# EAGLE design BSPDTesting (EAGLE 7.6.0)
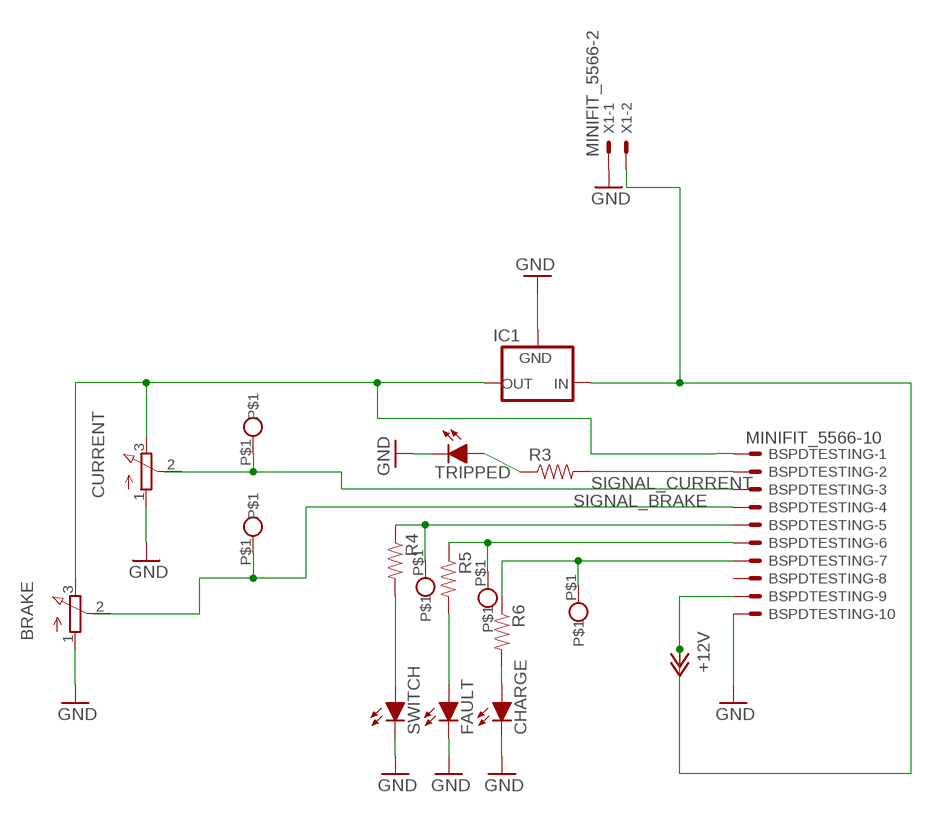
[diagram p0: schematic, sheet 1]

## Parts
BRAKE  3RP/1610N  [3RP/1610N]
BRAKEPROBE  TEST_POINT_COMPACT_THM  [TEST_POINT_COMPACT_THM]
BSPDTESTING  MINIFIT_5566-10  [MINIFIT_5566-10]
CHARGE  LED-3MM  [LED-3MM]
CURRENT  3RP/1610N  [3RP/1610N]
CURRENTPROBE  TEST_POINT_COMPACT_THM  [TEST_POINT_COMPACT_THM]
FAULT  LED-3MM  [LED-3MM]
IC1  5VREG_L7805_HOR  [TO-220-H]
R3  RESISTORAXIAL-0.3  [AXIAL-0.3]
R4  RESISTORAXIAL-0.3  [AXIAL-0.3]
R5  RESISTORAXIAL-0.3  [AXIAL-0.3]
R6  RESISTORAXIAL-0.3  [AXIAL-0.3]
SWITCH  LED-3MM  [LED-3MM]
TRIPPED  LED-3MM  [LED-3MM]
U$3  TEST_POINT_COMPACT_THM  [TEST_POINT_COMPACT_THM]
U$4  TEST_POINT_COMPACT_THM  [TEST_POINT_COMPACT_THM]
U$5  TEST_POINT_COMPACT_THM  [TEST_POINT_COMPACT_THM]
X1  MINIFIT_5566-2  [MINIFIT_5566-2]

## Nets
+12V: BSPDTESTING.9 IC1.1(IN) X1.2
GND: BRAKE.1(A) BSPDTESTING.10 CHARGE.K(C) CURRENT.1(A) FAULT.K(C) IC1.2(GND) SWITCH.K(C) TRIPPED.K(C) X1.1
N$1: BSPDTESTING.1
N$2: BSPDTESTING.2 R3.P$2
N$3: R3.P$1 TRIPPED.A
N$8: FAULT.A R5.P$2
N$9: BSPDTESTING.5 R4.P$1 U$3.P$1
N$10: BSPDTESTING.6 R5.P$1 U$4.P$1
N$12: R4.P$2 SWITCH.A
N$13: CHARGE.A R6.P$2
N$14: BSPDTESTING.7 R6.P$1 U$5.P$1
N$15: BRAKE.3(E) CURRENT.3(E) IC1.3(OUT)
SIGNAL_BRAKE: BRAKEPROBE.P$1 BSPDTESTING.4
SIGNAL_CURRENT: BSPDTESTING.3 CURRENTPROBE.P$1
Unconnected: BRAKE.2(S) BSPDTESTING.8 CURRENT.2(S)

## Library data of the parts
BRAKE CURRENT = HyTechDevices:3RP/1610N: 16mm Potentiometer one level Source: http://www.alphapotentiometers.net/html/16mm_pot_2.html
BRAKEPROBE CURRENTPROBE U$3-U$5 = HyTechDevices:TEST_POINT_COMPACT_THM
BSPDTESTING = HyTechDevices:MINIFIT_5566-10: Mini-Fit Junior connector 10 pole Source: http://www.molex.com; OC_FARNELL: unknown; OC_NEWARK: unknown
CHARGE FAULT SWITCH TRIPPED = HyTechDevices:LED: Light Emitting Diode (LED) Source: Dangerous Prototypes Eagle Library <https://github.com/DangerousPrototypes/Eagle_Part_Library>
IC1 = HyTechDevices:5VREG_L7805: Voltage Regulator Switching 5v regulator Datasheet <http://power.murata.com/data/power/oki-78sr.pdf> Standard 7805 5V regulator. IGO (Input Ground Output). Spark Fun Electronics SKU : COM-00107 Datasheet <http://www.mouser.com/ds/2/308/MC7800-D-94905.pdf>
R3-R6 = HyTechDevices:RESISTOR: Resistor Basic schematic elements and footprints for 0603, 1206, and PTH resistors.
X1 = HyTechDevices:MINIFIT_5566-2: Mini-Fit Junior connector 2 pole Source: http://www.molex.com; OC_FARNELL: 1822072; OC_NEWARK: unknown

## Board
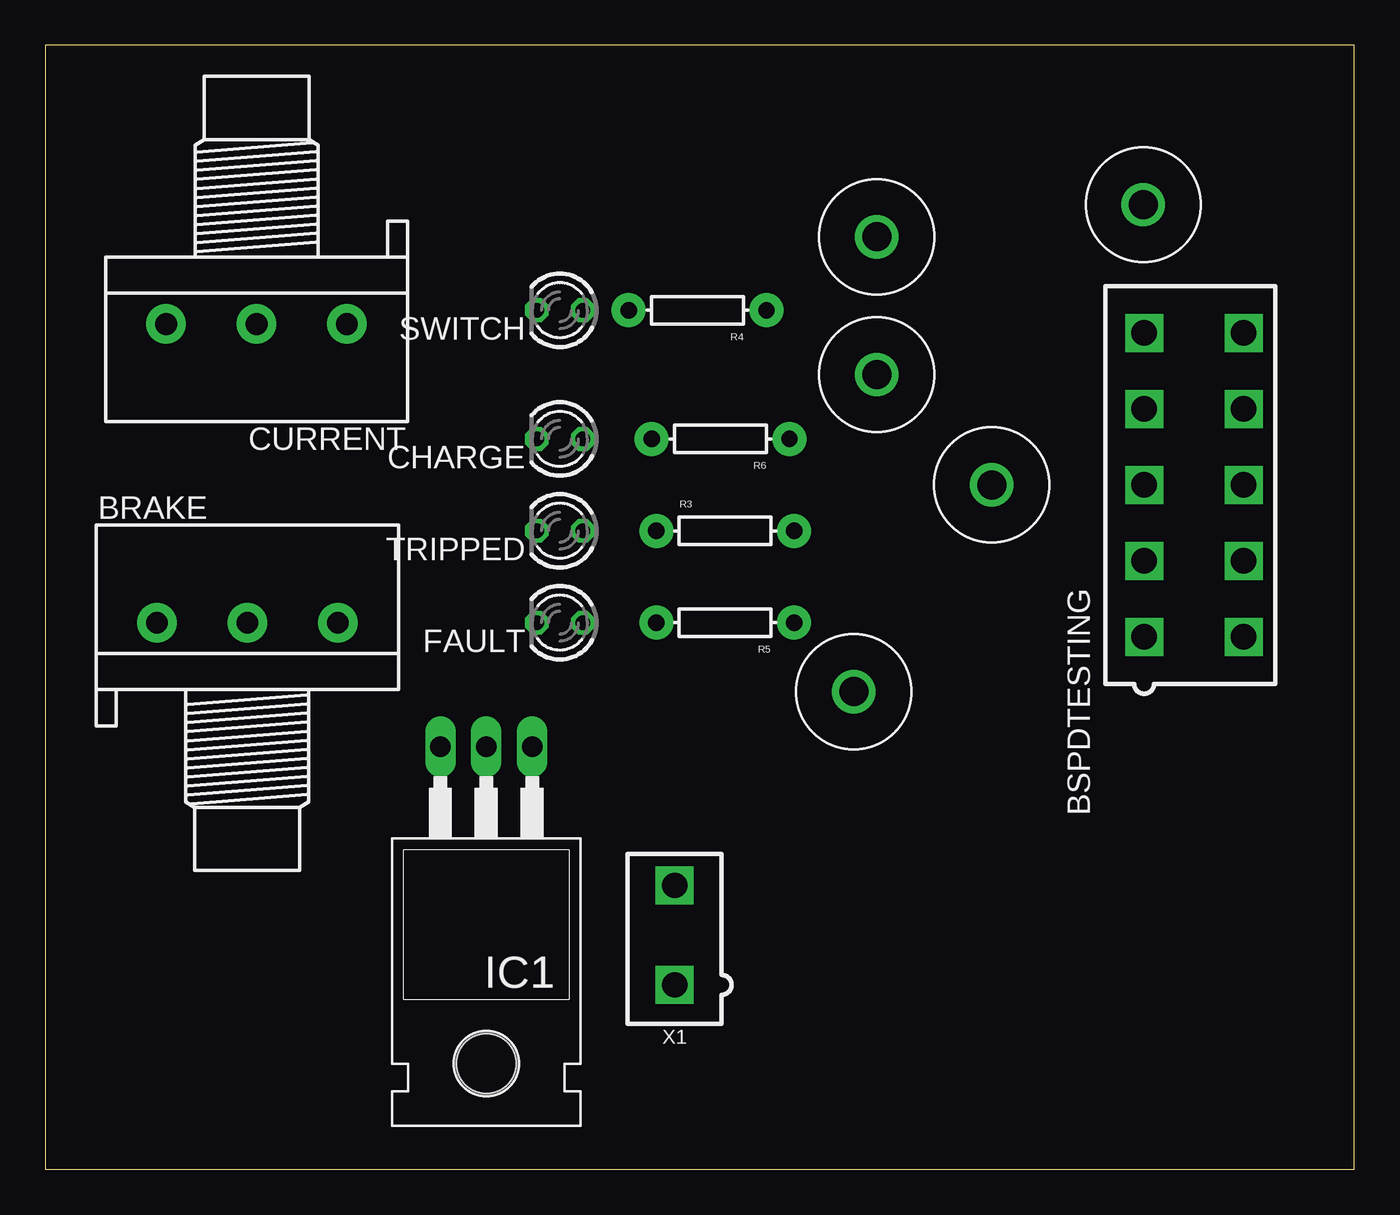
[diagram p1: board, top side]
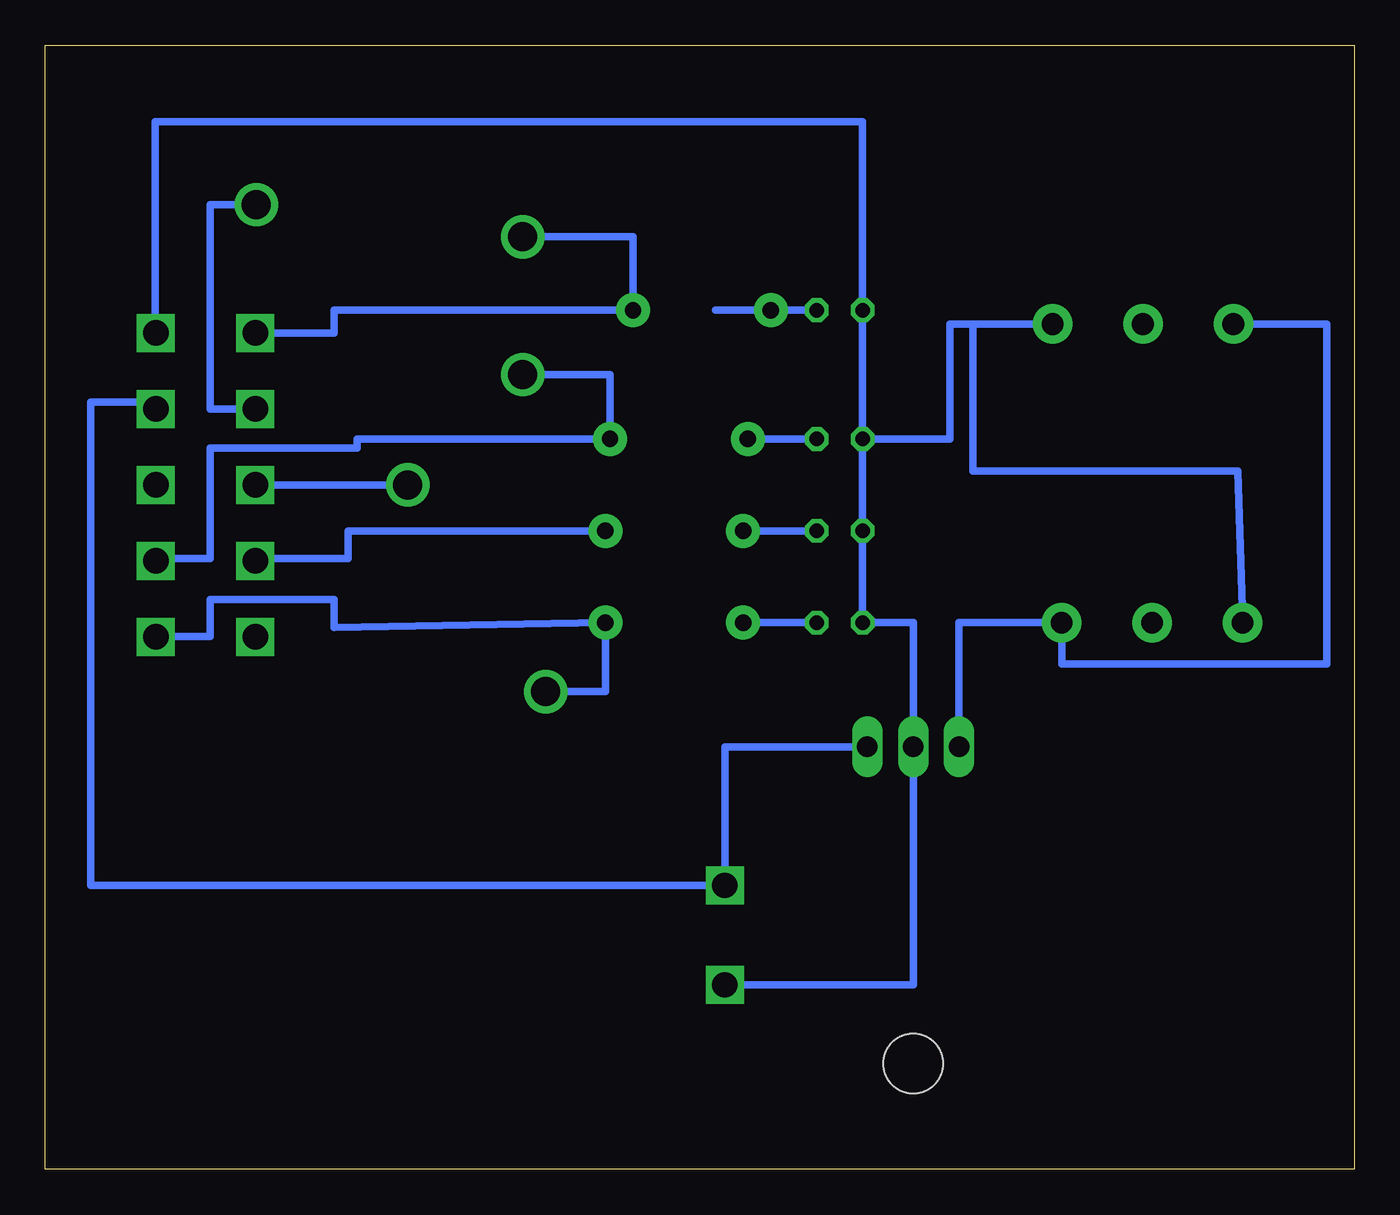
[diagram p2: board, bottom side, seen from below]

Size 72.37 x 62.15 mm. Coordinates in mm from the lower left corner, seen from the top.
Outline: 0,0 72.37,0 72.37,62.15 0,62.15 0,0
Copper layers (1*16): Top 0.035mm / dielectric 1.5mm / Bottom 0.035mm
Design rules "default": minimum track width 10mil, minimum drill 24mil, track to track 8mil, track to pad 8mil, pad to pad 8mil, via to via 8mil, smd to smd 8mil, copper to edge 40mil, drill to drill 8mil, minimum pad ring 10mil, minimum via ring 8mil, stop-mask expansion 4mil, vias tented up to drill 0mil, thermal gap 10mil

### Footprints (pad centres in the part's own frame; a part is rotated, then mirrored left to right if it is on the bottom)
3RP/1610N = drill 1.2 pad 2.184: 1 -5,0; 2 0,0; 3 5,0
TEST_POINT_COMPACT_THM = drill 1.6 pad 1.6: P$1 0,0
MINIFIT_5566-10 = drill 1.4 square: 1 8.4,-2.75; 2 4.2,-2.75; 3 0,-2.75; 4 -4.2,-2.75; 5 -8.4,-2.75; 6 8.4,2.75; 7 4.2,2.75; 8 0,2.75; 9 -4.2,2.75; 10 -8.4,2.75
LED-3MM = drill 0.813 octagon: A -1.27,0; K 1.27,0
TO-220-H = drill 1.118 long: 1 -2.54,-6.35; 2 0,-6.35; 3 2.54,-6.35 | hole 3.302: 0,11.176
AXIAL-0.3 = drill 0.9 pad 1.88: P$1 -3.81,0; P$2 3.81,0
MINIFIT_5566-2 = drill 1.4 square: 1 0,-2.75; 2 0,2.75

### Placement (x,y rotation side)
BRAKE  11.18,30.23 0 top
BRAKEPROBE  60.71,53.34 0 top
BSPDTESTING  63.5,37.85 270 top
CHARGE  28.45,40.39 180 top
CURRENT  11.68,46.74 180 top
CURRENTPROBE  52.32,37.85 0 top
FAULT  28.45,30.23 180 top
IC1  24.38,17.02 180 top
R3  37.59,35.31 0 top
R4  36.07,47.5 180 top
R5  37.59,30.23 180 top
R6  37.34,40.39 180 top
SWITCH  28.45,47.5 180 top
TRIPPED  28.45,35.31 180 top
U$3  45.97,51.56 0 top
U$4  44.7,26.42 0 top
U$5  45.97,43.94 0 top
X1  34.8,12.95 0 top

### Tracks (layer width: path | path; a pad name or v marks a point on that pad's centre or on a via)
+12V
  Bottom 0.406: BSPDTESTING.9 66.25,42.42 69.85,42.42 69.85,15.7 X1.2 34.8,23.37 IC1.1
GND
  Bottom 0.406: BSPDTESTING.10 66.29,46.25 66.29,57.91 27.18,57.91 SWITCH.K CHARGE.K | CHARGE.K TRIPPED.K FAULT.K 24.38,30.23 IC1.2 24.38,10.2 X1.1 | 21.08,46.74 22.35,46.74 22.35,40.39 CHARGE.K | CURRENT.1 21.08,46.74 | 21.08,46.74 21.08,38.61 6.43,38.61 BRAKE.1
N$2
  Bottom 0.406: R3.P$2 55.63,35.31 55.63,33.78 60.75,33.78 BSPDTESTING.2
N$3
  Bottom 0.406: R3.P$1 TRIPPED.A
N$8
  Bottom 0.406: FAULT.A R5.P$2
N$9
  Bottom 0.406: BSPDTESTING.5 56.39,46.25 56.39,47.5 R4.P$1 39.88,51.56 U$3.P$1
N$10
  Bottom 0.406: BSPDTESTING.6 66.25,29.46 63.25,29.46 63.25,31.5 56.39,31.5 56.39,29.97 R5.P$1 41.4,26.42 U$4.P$1
N$12
  Bottom 0.406: 35.31,47.5 R4.P$2 SWITCH.A
N$13
  Bottom 0.406: CHARGE.A R6.P$2
N$14
  Bottom 0.406: BSPDTESTING.7 66.25,33.78 63.25,33.78 63.25,39.88 55.12,39.88 55.12,40.39 R6.P$1 41.15,43.94 U$5.P$1
N$15
  Bottom 0.406: IC1.3 21.84,30.23 BRAKE.3 16.18,27.94 1.52,27.94 1.52,46.74 CURRENT.3
SIGNAL_BRAKE
  Bottom 0.406: BSPDTESTING.4 63.25,42.05 63.25,53.34 BRAKEPROBE.P$1
SIGNAL_CURRENT
  Bottom 0.406: BSPDTESTING.3 CURRENTPROBE.P$1